# Altium schematic sheet [3] Relay Implausibility.SchDoc
size A4
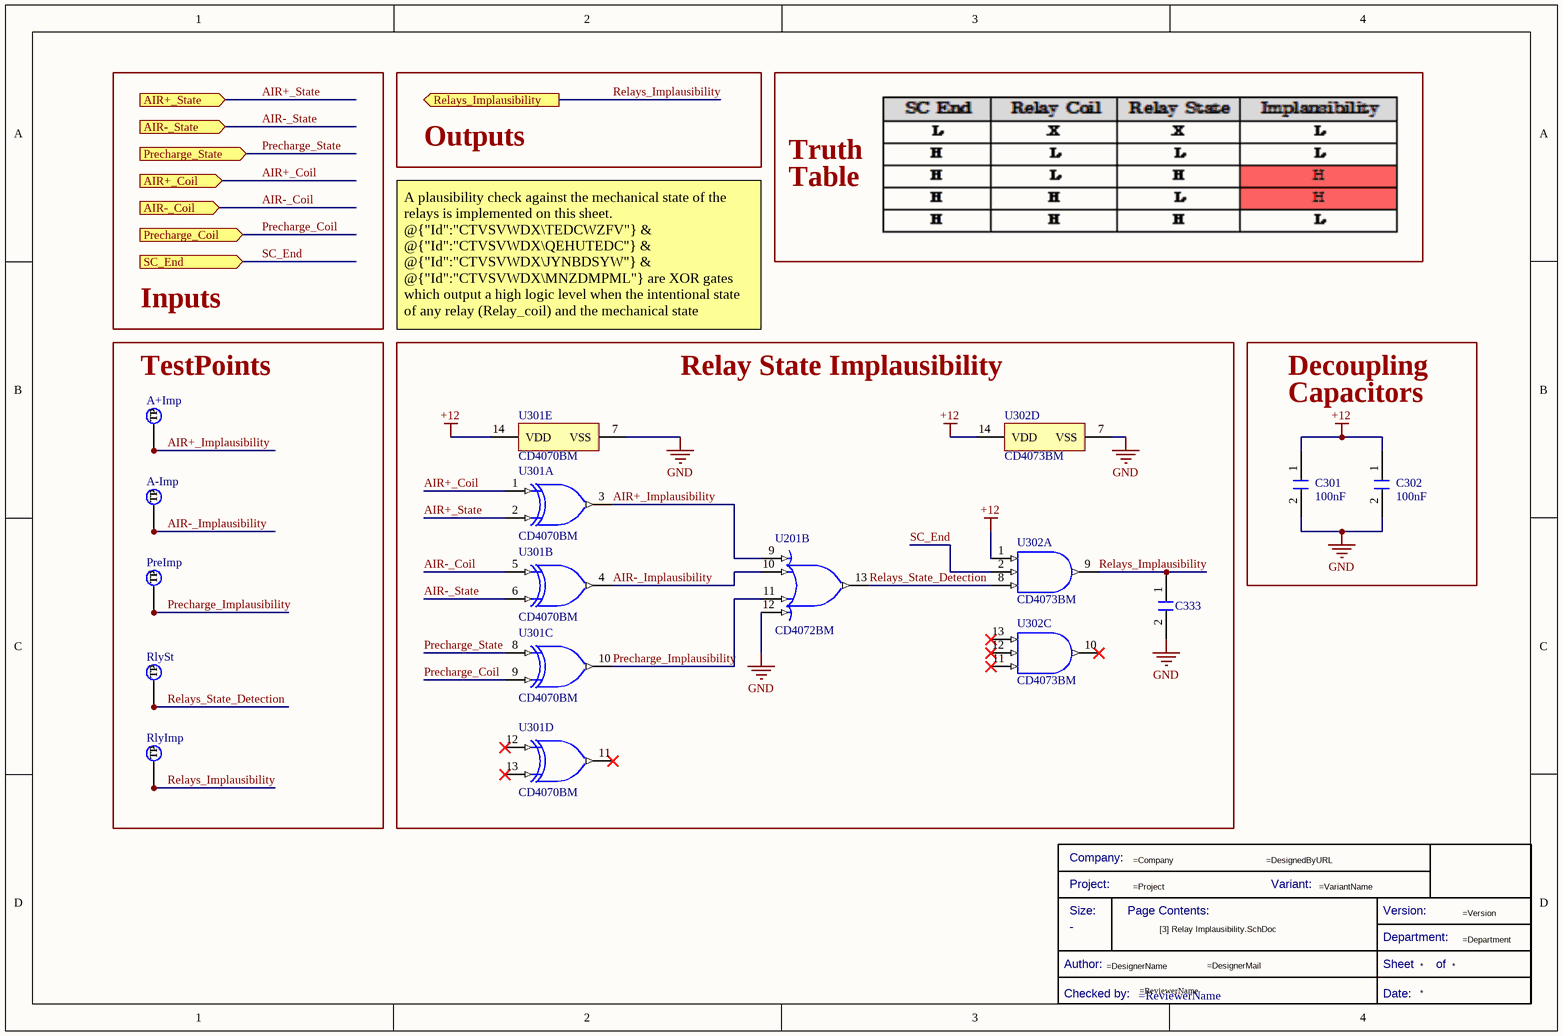
[diagram p0: [3] Relay Implausibility.SchDoc]

## Parts
*  Title Block_template  (value not drawn)  (graphical)
A+Imp  TestPoint  [TestPoint]  (value not drawn)  (no BOM)
A-Imp  TestPoint  [TestPoint]  (value not drawn)  (no BOM)
C301  value 100nF  [C0805FNPC-R]  (hidden comment: C100n-50V-0805FNPC-X7R)
C302  value 100nF  [C0805FNPC-R]  (hidden comment: C100n-50V-0805FNPC-X7R)
C333  C15p-50V-0805FNPC-NP0  [C0805FNPC-R]  (value not drawn)
PreImp  TestPoint  [TestPoint]  (value not drawn)  (no BOM)
RlyImp  TestPoint  [TestPoint]  (value not drawn)  (no BOM)
RlySt  TestPoint  [TestPoint]  (value not drawn)  (no BOM)
U201  CD4072BM  [D0014A_N]  (part B of 3)
U301  CD4070BM  [D0014A_N]  (parts A,B,C,D,E of 5)
U302  CD4073BM  [D0014A_N]  (parts A,C,D of 4)

## Blocks framed on the sheet
TestPoints: A+Imp A-Imp PreImp RlyImp RlySt
Relay State Implausibility: C333 U201 U301 U302

## Ports
AIR+_Coil (in, see [2] Implausibilities[3A], [1] TSAL_Green[2A], [2] Implausibilities[1A], [4] NoHV_RelaysClosed[1A]), AIR+_State (in, see [2] Implausibilities[3A], [1] TSAL_Green[2A], [2] Implausibilities[1A], [5] SCS[1A]), AIR-_Coil (in, see [2] Implausibilities[3A], [1] TSAL_Green[2A], [2] Implausibilities[1A], [4] NoHV_RelaysClosed[1A]), AIR-_State (in, see [2] Implausibilities[3A], [1] TSAL_Green[2A], [2] Implausibilities[1A], [5] SCS[1A]), Precharge_Coil (in, see [2] Implausibilities[3A], [1] TSAL_Green[2B], [2] Implausibilities[1A], [4] NoHV_RelaysClosed[1A]), Precharge_State (in, see [2] Implausibilities[3A], [1] TSAL_Green[2A], [2] Implausibilities[1A], [5] SCS[1A]), Relays_Implausibility (out, see [2] Implausibilities[4A]), SC_End (in, see [2] Implausibilities[4A], [1] TSAL_Green[2B], [2] Implausibilities[1A], [4] NoHV_RelaysClosed[1A])

## Nets
+12: C301.1 C302.1 U301.14(VDD) U302.1(A) U302.14(VDD)
GND: C301.2 C302.2 C333.2 U201.12(H) U301.7(VSS) U302.7(VSS)
AIR+_Coil: U301.1(A) ; port AIR+_Coil
AIR+_Implausibility: A+Imp.1(TP) U201.9(E) U301.3(J)
AIR+_State: U301.2(B) ; port AIR+_State
AIR-_Coil: U301.5(C) ; port AIR-_Coil
AIR-_Implausibility: A-Imp.1(TP) U201.10(F) U301.4(K)
AIR-_State: U301.6(D) ; port AIR-_State
Precharge_Coil: U301.9(F) ; port Precharge_Coil
Precharge_Implausibility: PreImp.1(TP) U201.11(G) U301.10(L)
Precharge_State: U301.8(E) ; port Precharge_State
Relays_Implausibility: C333.1 RlyImp.1(TP) U302.9(J) ; port Relays_Implausibility
Relays_State_Detection: RlySt.1(TP) U201.13(K) U302.8(C)
SC_End: U302.2(B) ; port SC_End

Not connected (* = marked no-connect by the designer): U301 11(M)* 12(G)* 13(H)*; U302 10(L)* 11(I)* 12(H)* 13(G)*

## Notes on the sheet
- Outputs
- Truth
- Table
- Inputs
- A plausibility check against the mechanical state of the relays is implemented on this sheet. @{"Id":"CTVSVWDX\TEDCWZFV"} & @{"Id":"CTVSVWDX\QEHUTEDC"} & @{"Id":"CTVSVWDX\JYNBDSYW"} & @{"Id":"CTVSVWDX\MNZDMPML"} are XOR gates which output a high logic level when the intentional state of any relay (Relay_coil) and the mechanical state (Relay_state) differ.
  As the Relay's Coil inside the TSAC are supplied directly from the Shutdown Chain, the @{"Id":"CTVSVWDX\UYTFIWRP"} conditions the implausibility detection with the SC to be closed.
- Decoupling
- Capacitors
- (in symbol CMP-00043-8) Company:; Project:; Variant:; Size:; Page Contents:; Version:; Department:; Author:; Sheet; of; Checked by:; Date:

## Library data of the parts
* = CMP-00043-8: Standard Title Block; .SCHcheck: GP; Checked by:: =ReviewerName; Size: -; Design Item ID: Title Block_template; .PCBcheck: GP; .Creator: GP; Source: e-Tech_Racing.SchLib; Category: Title Block
A+Imp A-Imp PreImp RlyImp RlySt = CMP-00042-2: Test Point 1x1 mm; .SCHcheck: GP; Category: TestPoint; Source: e-Tech_Racing.SchLib; .Creator: GP; .PCBcheck: GP; Design Item ID: TestPoint
C301 C302 = CMP-00063-3: Cap, 0.1ΜF, 50V, 10%, X7R, 0805; Manufacturer Part Number 1: 885012207098; Manufacturer 1: Wurth Electronics; .Creator: DR; ComponentLink2Description: http://www.farnell.com/datasheets/1958498.pdf?src-supplier=Element14; ComponentLink1Description: http://www.farnell.com/datasheets/1958498.pdf?src-supplier=Farnell; Thickness: 0.035inch; ComponentLink1URL: http://www.farnell.com/datasheets/1958498.pdf?src-supplier=Farnell; Min Operating Temperature: -55°C; Packaging: Cut Tape; ComponentLink2URL: http://www.farnell.com/datasheets/1958498.pdf?src-supplier=Element14; Mount: Surface Mount; Voltage Rating (DC): 50V; Tolerance: 10%; Category: Ceramic Capacitors; RoHS: Yes; Width: 0.049inch; Pricing 1: 100=0,10200, 500=0,07100, 2000=0,06100 (GBP); RoHS Compliant: Yes; ComponentLink4Description: http://www.farnell.com/datasheets/1958498.pdf?src-supplier=Newark; Dielectric: X7R; Stock 1: 8000; Length: 0.079inch; ComponentLink3URL: https://katalog.we-online.de/pbs/datasheet/885012207098.pdf?src-supplier=Digi-Key; ComponentLink3Description: https://katalog.we-online.de/pbs/datasheet/885012207098.pdf?src-supplier=Digi-Key; Design Item ID: C100n-50V-0805FNPC-X7R; ComponentLink4URL: http://www.farnell.com/datasheets/1958498.pdf?src-supplier=Newark; REACH SVHC: Unknown; Case Code (Metric): 2012; Voltage Rating: 50V; Max Operating Temperature: 125°C; Source: Passives.SchLib; Case/Package: 0805
C333 = CMP-00056-3: Cap, 15PF, 50V, 5%, C0G/NP0, 0805; Manufacturer Part Number 1: 885012007052; Manufacturer 1: Wurth Electronics; .Creator: DR; Thickness: 0.028inch; RoHS Compliant: Yes; ComponentLink2URL: http://katalog.we-online.de/pbs/datasheet/885012007052.pdf?src-supplier=Digi-Key; Design Item ID: C15p-50V-0805FNPC-NP0; Case Code (Metric): 2012; Max Operating Temperature: 125°C; Mount: Surface Mount; Category: Ceramic Capacitors; Min Operating Temperature: -55°C; Case/Package: 0805; ComponentLink3Description: https://katalog.we-online.de/pbs/datasheet/885012007052.pdf?src-supplier=Digi-Key; ComponentLink1Description: http://www.farnell.com/datasheets/2031702.pdf?src-supplier=Farnell; ComponentLink1URL: http://www.farnell.com/datasheets/2031702.pdf?src-supplier=Farnell; RoHS: Yes; Voltage Rating: 50V; Length: 0.079inch; Source: Passives.SchLib; Value: 15pF; Pricing 1: 1=0,10800, 10=0,05200, 25=0,05100, 50=0,04900, 100=0,04800, 250=0,04600, 500=0,04300 (USD); Tolerance: 5%; ComponentLink3URL: https://katalog.we-online.de/pbs/datasheet/885012007052.pdf?src-supplier=Digi-Key; Stock 1: 815; Packaging: Cut Tape; Width: 0.049inch; ComponentLink2Description: http://katalog.we-online.de/pbs/datasheet/885012007052.pdf?src-supplier=Digi-Key
U201 = CMP-00217-1: OR Gate, 4000/14000/40000 Series, 2-Func, 4-Input, CMOS, PDSO14; Package Equivalence Code: SOP14,.25; Package Body Material: Plastic; Power Supplies: 5/15V; Schmitt Trigger: No; Propagation Delay (tpd): 250ns; Nominal Supply Voltage: 5V; Min Supply Voltage: 3V; Channels: 2; Output Characteristics: OPEN-COLLECTOR; Max Supply Voltage: 18V; Load Capacitance (CL): 50pF; Logic Type: OR GATE; Qualification Status: Not Qualified; Number of Inputs: 4; Length: 8.65mm; Technology: CMOS; Surface Mount: Yes; Packaging: Rail/Tube; JESD-609 Code: e4; Terminal Pitch: 1.27mm; Package Shape: Rectangular; Package Style: SMALL OUTLINEMeter; Max Operating Temperature: 125°C; Terminal Position: DUAL; Reach SVHC Compliant: Yes; Terminal Form: Gull Wing; JESD-30 Code: R-PDSO-G14; Width: 3.9mm; Moisture Sensitivity Level: 1; Peak Reflow Temperature (Cel): 260°C; Temperature Grade: MILITARY; Pins: 14; Case/Package: SOP; Terminal Finish: Nickel; Min Operating Temperature: -55°C; Height - Seated (Max): 1.75mm; Prop. Delay@Nom-Sup: 250ns; RoHS Compliant: Yes
U301 = CMP-00216-1: XOR Gate, 4000/14000/40000 Series, 4-Func, 2-Input, CMOS, PDSO14; Package Equivalence Code: SOP14,.25; Number of Inputs: 2; Nominal Supply Voltage: 5V; Qualification Status: Not Qualified; Max Supply Voltage: 18V; Channels: 4; Min Supply Voltage: 3V; Prop. Delay@Nom-Sup: 280ns; Package Body Material: Plastic; Schmitt Trigger: No; Load Capacitance (CL): 50pF; Power Supplies: 5/15V; RoHS Compliant: Yes; Temperature Grade: MILITARY; Max Operating Temperature: 125°C; Packaging: Tape and Reel; Peak Reflow Temperature (Cel): 260°C; Height - Seated (Max): 1.75mm; Surface Mount: Yes; Technology: CMOS; Terminal Finish: Nickel; Terminal Pitch: 1.27mm; JESD-609 Code: e4; JESD-30 Code: R-PDSO-G14; Case/Package: SOP; Moisture Sensitivity Level: 1; Terminal Form: Gull Wing; Min Operating Temperature: -55°C; Width: 3.9mm; Length: 8.65mm; Terminal Position: DUAL; Pins: 14; Reach SVHC Compliant: Yes; Package Style: SMALL OUTLINEMeter; Logic Type: XOR GATE; Propagation Delay (tpd): 280ns; Package Shape: Rectangular
U302 = CMP-00213-1: AND Gate, 4000/14000/40000 Series, 3-Func, 3-Input, CMOS, PDSO14; Propagation Delay (tpd): 250ns; Nominal Supply Voltage: 5V; Power Supplies: 5/15V; Qualification Status: Not Qualified; Package Equivalence Code: SOP14,.25; Channels: 3; Min Supply Voltage: 3V; Package Body Material: Plastic; Max Supply Voltage: 18V; Load Capacitance (CL): 50pF; Load/Preset Input: Yes; Schmitt Trigger: No; Terminal Pitch: 1.27mm; Terminal Form: Gull Wing; Length: 8.65mm; Logic Type: AND GATE; Prop. Delay@Nom-Sup: 250ns; Package Style: SMALL OUTLINEMeter; JESD-609 Code: e4; Package Shape: Rectangular; Moisture Sensitivity Level: 1; Max Operating Temperature: 125°C; Min Operating Temperature: -55°C; Case/Package: SOP; Terminal Finish: Nickel; Width: 3.9mm; Surface Mount: Yes; Reach SVHC Compliant: Yes; Technology: CMOS; Terminal Position: DUAL; Height - Seated (Max): 1.75mm; Temperature Grade: MILITARY; Number of Inputs: 3; Packaging: Rail/Tube; Pins: 14; Peak Reflow Temperature (Cel): 260°C; JESD-30 Code: R-PDSO-G14; RoHS Compliant: Yes